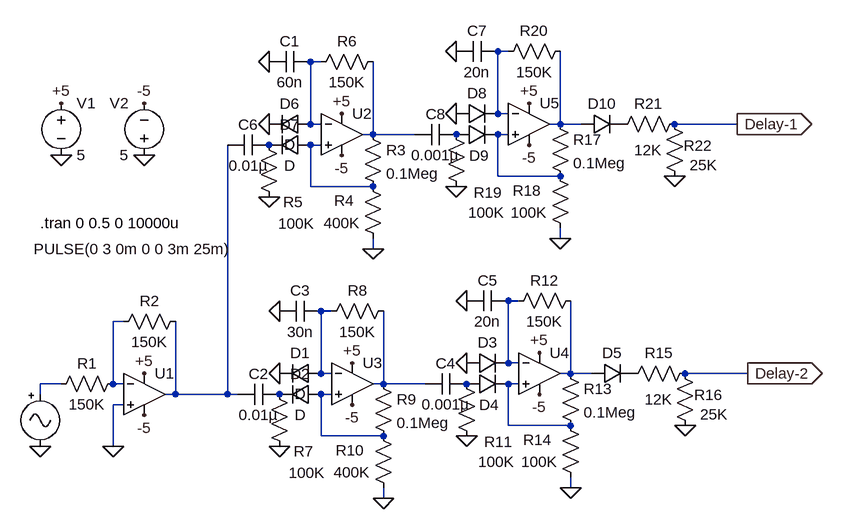
[diagram p0: schematic Delay.asc]
Delay.asc, the LTspice schematic file:
Version 4
SHEET 1 2784 1552
WIRE 512 -720 496 -720
WIRE 224 -704 208 -704
WIRE 496 -624 496 -720
WIRE 512 -624 496 -624
WIRE 208 -608 208 -704
WIRE 224 -608 208 -608
WIRE 592 -608 592 -720
WIRE 592 -608 576 -608
WIRE 624 -608 592 -608
WIRE 864 -608 768 -608
WIRE 304 -592 304 -704
WIRE 304 -592 288 -592
WIRE 368 -592 304 -592
WIRE 512 -592 496 -592
WIRE 224 -576 208 -576
WIRE 496 -528 496 -592
WIRE 592 -528 496 -528
WIRE 208 -512 208 -576
WIRE 304 -512 208 -512
WIRE 592 -432 592 -448
WIRE 304 -416 304 -432
WIRE 528 -336 512 -336
WIRE 240 -320 224 -320
WIRE -80 -304 -96 -304
WIRE 512 -240 512 -336
WIRE 528 -240 512 -240
WIRE 224 -224 224 -320
WIRE 240 -224 224 -224
WIRE 608 -224 608 -336
WIRE 608 -224 592 -224
WIRE 640 -224 608 -224
WIRE 880 -224 784 -224
WIRE -176 -208 -208 -208
WIRE -96 -208 -96 -304
WIRE -80 -208 -96 -208
WIRE 320 -208 320 -320
WIRE 320 -208 304 -208
WIRE 384 -208 320 -208
WIRE 528 -208 512 -208
WIRE -208 -192 -208 -208
WIRE 0 -192 0 -304
WIRE 0 -192 -16 -192
WIRE 80 -192 80 -576
WIRE 80 -192 0 -192
WIRE 96 -192 80 -192
WIRE 240 -192 224 -192
WIRE -80 -176 -96 -176
WIRE 512 -144 512 -208
WIRE 608 -144 512 -144
WIRE 224 -128 224 -192
WIRE 320 -128 224 -128
WIRE -96 -112 -96 -176
WIRE 608 -48 608 -64
WIRE 320 -32 320 -48
FLAG -208 -112 0
FLAG 272 -240 +5
FLAG 272 -176 -5
FLAG 160 -224 0
FLAG 160 -320 0
FLAG 160 -112 0
FLAG 320 -32 0
FLAG -176 -560 0
FLAG -48 -560 0
FLAG -48 -640 -5
FLAG -176 -640 +5
FLAG 560 -256 +5
FLAG 560 -192 -5
FLAG 448 -240 0
FLAG 448 -336 0
FLAG 448 -128 0
FLAG 608 -48 0
FLAG 784 -144 0
FLAG 880 -224 Delay-2
IOPIN 880 -224 Out
FLAG -48 -224 +5
FLAG -48 -160 -5
FLAG -96 -112 0
FLAG 256 -624 +5
FLAG 256 -560 -5
FLAG 144 -608 0
FLAG 144 -704 0
FLAG 144 -496 0
FLAG 304 -416 0
FLAG 544 -640 +5
FLAG 544 -576 -5
FLAG 432 -624 0
FLAG 432 -720 0
FLAG 432 -512 0
FLAG 592 -432 0
FLAG 768 -528 0
FLAG 864 -608 Delay-1
IOPIN 864 -608 Out
SYMBOL Opamps\\UniversalOpamp2 272 -208 R0
SYMATTR InstName U3
SYMBOL diode 224 -240 R90
WINDOW 0 0 32 VBottom 2
WINDOW 3 32 32 VTop 2
SYMATTR InstName D1
SYMBOL diode 224 -208 R90
WINDOW 0 0 32 VBottom 2
WINDOW 3 32 32 VTop 2
SYMATTR InstName D2
SYMBOL res 304 -224 R0
SYMATTR InstName R9
SYMATTR Value 0.1Meg
SYMBOL res 336 -32 R180
WINDOW 0 45 74 Left 2
WINDOW 3 36 40 Left 2
SYMATTR InstName R10
SYMATTR Value 400K
SYMBOL res 144 -208 R0
WINDOW 0 38 104 Left 2
WINDOW 3 30 137 Left 2
SYMATTR InstName R7
SYMATTR Value 100K
SYMBOL res 336 -336 R90
WINDOW 0 0 56 VBottom 2
WINDOW 3 32 56 VTop 2
SYMATTR InstName R8
SYMATTR Value 150K
SYMBOL cap 224 -336 R90
WINDOW 0 0 32 VBottom 2
WINDOW 3 32 32 VTop 2
SYMATTR InstName C3
SYMATTR Value 30n
SYMBOL cap 160 -208 R90
WINDOW 0 0 32 VBottom 2
WINDOW 3 32 32 VTop 2
SYMATTR InstName C2
SYMATTR Value 0.01µ
SYMBOL voltage -176 -656 R0
WINDOW 123 0 0 Left 2
WINDOW 39 0 0 Left 2
SYMATTR InstName V1
SYMATTR Value 5
SYMBOL voltage -48 -544 R180
WINDOW 0 24 96 Left 2
WINDOW 3 24 16 Left 2
WINDOW 123 0 0 Left 2
WINDOW 39 0 0 Left 2
SYMATTR InstName V2
SYMATTR Value 5
SYMBOL Misc\\signal -208 -208 R0
WINDOW 0 24 16 Invisible 2
WINDOW 3 -10 -208 Left 2
WINDOW 123 0 0 Left 2
WINDOW 39 0 0 Left 2
SYMATTR InstName V3
SYMATTR Value PULSE(0 3 0m 0 0 3m 25m)
SYMBOL Opamps\\UniversalOpamp2 560 -224 R0
SYMATTR InstName U4
SYMBOL diode 448 -224 R270
WINDOW 0 32 32 VTop 2
WINDOW 3 0 32 Invisible 2
SYMATTR InstName D3
SYMBOL diode 448 -192 R270
WINDOW 0 -32 35 VTop 2
WINDOW 3 0 32 Invisible 2
SYMATTR InstName D4
SYMBOL res 592 -240 R0
SYMATTR InstName R13
SYMATTR Value 0.1Meg
SYMBOL res 624 -48 R180
WINDOW 0 45 74 Left 2
WINDOW 3 36 40 Left 2
SYMATTR InstName R14
SYMATTR Value 100K
SYMBOL res 432 -224 R0
WINDOW 0 43 105 Left 2
WINDOW 3 34 136 Left 2
SYMATTR InstName R11
SYMATTR Value 100K
SYMBOL res 624 -352 R90
WINDOW 0 0 56 VBottom 2
WINDOW 3 32 56 VTop 2
SYMATTR InstName R12
SYMATTR Value 150K
SYMBOL cap 512 -352 R90
WINDOW 0 0 32 VBottom 2
WINDOW 3 32 32 VTop 2
SYMATTR InstName C5
SYMATTR Value 20n
SYMBOL cap 448 -224 R90
WINDOW 0 0 32 VBottom 2
WINDOW 3 32 32 VTop 2
SYMATTR InstName C4
SYMATTR Value 0.001µ
SYMBOL diode 640 -208 R270
WINDOW 0 32 32 VTop 2
WINDOW 3 0 32 Invisible 2
SYMATTR InstName D5
SYMBOL res 800 -240 R90
WINDOW 0 0 56 VBottom 2
WINDOW 3 40 57 VTop 2
SYMATTR InstName R15
SYMATTR Value 12K
SYMBOL res 800 -128 R180
WINDOW 0 -42 63 Left 2
WINDOW 3 -50 33 Left 2
SYMATTR InstName R16
SYMATTR Value 25K
SYMBOL Opamps\\UniversalOpamp2 -48 -192 R0
SYMATTR InstName U1
SYMBOL res 16 -320 R90
WINDOW 0 0 56 VBottom 2
WINDOW 3 32 56 VTop 2
SYMATTR InstName R2
SYMATTR Value 150K
SYMBOL res -80 -224 R90
WINDOW 0 0 56 VBottom 2
WINDOW 3 32 56 VTop 2
SYMATTR InstName R1
SYMATTR Value 150K
SYMBOL Opamps\\UniversalOpamp2 256 -592 R0
SYMATTR InstName U2
SYMBOL diode 208 -624 R90
WINDOW 0 0 32 VBottom 2
WINDOW 3 32 32 VTop 2
SYMATTR InstName D6
SYMBOL diode 208 -592 R90
WINDOW 0 0 32 VBottom 2
WINDOW 3 32 32 VTop 2
SYMATTR InstName D7
SYMBOL res 288 -608 R0
SYMATTR InstName R3
SYMATTR Value 0.1Meg
SYMBOL res 320 -416 R180
WINDOW 0 45 74 Left 2
WINDOW 3 36 40 Left 2
SYMATTR InstName R4
SYMATTR Value 400K
SYMBOL res 128 -592 R0
WINDOW 0 38 104 Left 2
WINDOW 3 30 137 Left 2
SYMATTR InstName R5
SYMATTR Value 100K
SYMBOL res 320 -720 R90
WINDOW 0 0 56 VBottom 2
WINDOW 3 32 56 VTop 2
SYMATTR InstName R6
SYMATTR Value 150K
SYMBOL cap 208 -720 R90
WINDOW 0 0 32 VBottom 2
WINDOW 3 32 32 VTop 2
SYMATTR InstName C1
SYMATTR Value 60n
SYMBOL cap 144 -592 R90
WINDOW 0 0 32 VBottom 2
WINDOW 3 32 32 VTop 2
SYMATTR InstName C6
SYMATTR Value 0.01µ
SYMBOL Opamps\\UniversalOpamp2 544 -608 R0
SYMATTR InstName U5
SYMBOL diode 432 -608 R270
WINDOW 0 32 32 VTop 2
WINDOW 3 0 32 Invisible 2
SYMATTR InstName D8
SYMBOL diode 432 -576 R270
WINDOW 0 -32 35 VTop 2
WINDOW 3 0 32 Invisible 2
SYMATTR InstName D9
SYMBOL res 576 -624 R0
SYMATTR InstName R17
SYMATTR Value 0.1Meg
SYMBOL res 608 -432 R180
WINDOW 0 45 74 Left 2
WINDOW 3 36 40 Left 2
SYMATTR InstName R18
SYMATTR Value 100K
SYMBOL res 416 -608 R0
WINDOW 0 43 105 Left 2
WINDOW 3 34 136 Left 2
SYMATTR InstName R19
SYMATTR Value 100K
SYMBOL res 608 -736 R90
WINDOW 0 0 56 VBottom 2
WINDOW 3 32 56 VTop 2
SYMATTR InstName R20
SYMATTR Value 150K
SYMBOL cap 496 -736 R90
WINDOW 0 0 32 VBottom 2
WINDOW 3 32 32 VTop 2
SYMATTR InstName C7
SYMATTR Value 20n
SYMBOL cap 432 -608 R90
WINDOW 0 0 32 VBottom 2
WINDOW 3 32 32 VTop 2
SYMATTR InstName C8
SYMATTR Value 0.001µ
SYMBOL diode 624 -592 R270
WINDOW 0 32 32 VTop 2
WINDOW 3 0 32 Invisible 2
SYMATTR InstName D10
SYMBOL res 784 -624 R90
WINDOW 0 0 56 VBottom 2
WINDOW 3 40 57 VTop 2
SYMATTR InstName R21
SYMATTR Value 12K
SYMBOL res 784 -512 R180
WINDOW 0 -42 63 Left 2
WINDOW 3 -50 33 Left 2
SYMATTR InstName R22
SYMATTR Value 25K
TEXT -208 -456 Left 2 !.tran 0 0.5 0 10000u

The netlist it stands for:
* Delay.asc
XU3 N015 N008 +5 -5 N012 level.2 Avol=1Meg GBW=10Meg Slew=10Meg ilimit=25m rail=0 Vos=0 phimargin=45 en=0 enk=0 in=0 ink=0 Rin=500Meg  ; pins IN+ IN- V+ V- OUT
D1 N008 0 D
D2 N015 P001 D
R9 N012 N015 0.1Meg
R10 0 N015 400K
R7 P001 0 100K
R8 N012 N008 150K
C3 N008 0 30n
C2 P001 N014 0.01µ
V1 +5 0 5
V2 0 -5 5
V3 N011 0 PULSE(0 3 0m 0 0 3m 25m)
XU4 N013 N007 +5 -5 N010 level.2 Avol=1Meg GBW=10Meg Slew=10Meg ilimit=25m rail=0 Vos=0 phimargin=45 en=0 enk=0 in=0 ink=0 Rin=500Meg  ; pins IN+ IN- V+ V- OUT
D3 0 N007 D
D4 P002 N013 D
R13 N010 N013 0.1Meg
R14 0 N013 100K
R11 P002 0 100K
R12 N010 N007 150K
C5 N007 0 20n
C4 P002 N012 0.001µ
D5 N010 P003 D
R15 Delay-2 P003 12K
R16 0 Delay-2 25K
XU1 0 N009 +5 -5 N014 level.2 Avol=1Meg GBW=10Meg Slew=10Meg ilimit=25m rail=0 Vos=0 phimargin=45 en=0 enk=0 in=0 ink=0 Rin=500Meg  ; pins IN+ IN- V+ V- OUT
R2 N014 N009 150K
R1 N009 N011 150K
XU2 N006 N002 +5 -5 N004 level.2 Avol=1Meg GBW=10Meg Slew=10Meg ilimit=25m rail=0 Vos=0 phimargin=45 en=0 enk=0 in=0 ink=0 Rin=500Meg  ; pins IN+ IN- V+ V- OUT
D6 N002 0 D
D7 N006 P004 D
R3 N004 N006 0.1Meg
R4 0 N006 400K
R5 P004 0 100K
R6 N004 N002 150K
C1 N002 0 60n
C6 P004 N014 0.01µ
XU5 N005 N001 +5 -5 N003 level.2 Avol=1Meg GBW=10Meg Slew=10Meg ilimit=25m rail=0 Vos=0 phimargin=45 en=0 enk=0 in=0 ink=0 Rin=500Meg  ; pins IN+ IN- V+ V- OUT
D8 0 N001 D
D9 P005 N005 D
R17 N003 N005 0.1Meg
R18 0 N005 100K
R19 P005 0 100K
R20 N003 N001 150K
C7 N001 0 20n
C8 P005 N004 0.001µ
D10 N003 P006 D
R21 Delay-1 P006 12K
R22 0 Delay-1 25K
.model D D
.lib standard.dio
.tran 0 0.5 0 10000u
.lib UniversalOpamps2.sub
.backanno
.end